# EAGLE design Teensylu-0.1 (EAGLE 5.11)
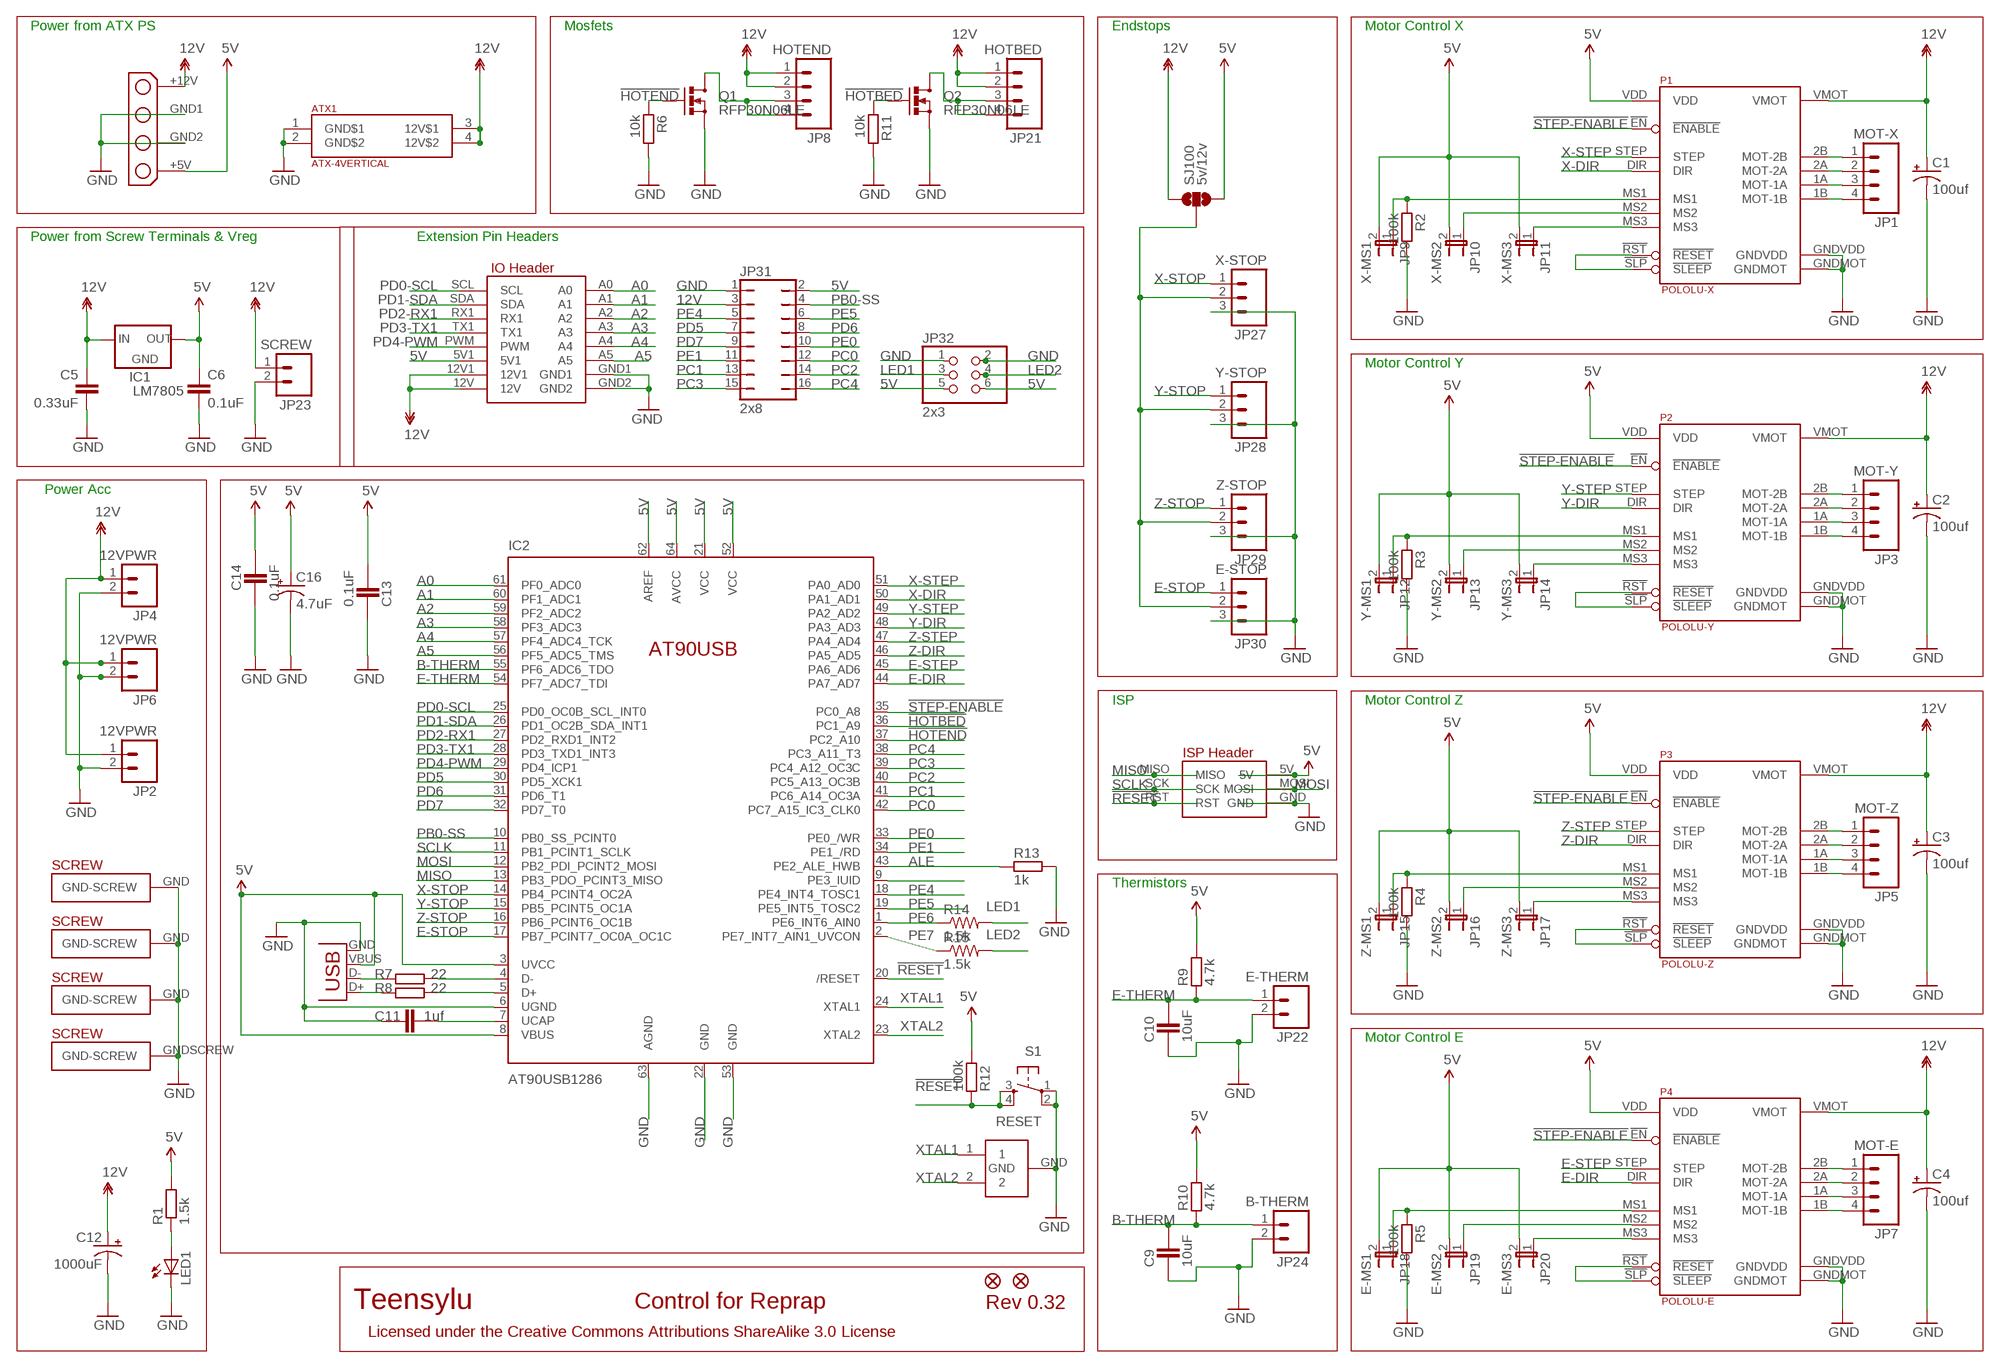
[diagram p0: schematic, sheet 1]

## Parts
ATX1  ATX-4VERTICAL  [MINIFITJR-4-VERTICAL]
C1  100uf  CAP_POLPTH1  [CPOL-RADIAL-100UF-25V]
C2  100uf  CAP_POLPTH1  [CPOL-RADIAL-100UF-25V]
C3  100uf  CAP_POLPTH1  [CPOL-RADIAL-100UF-25V]
C4  100uf  CAP_POLPTH1  [CPOL-RADIAL-100UF-25V]
C5  0.33uF  CAPPTH2  [CAP-PTH-SMALL2]
C6  0.1uF  CAPPTH2  [CAP-PTH-SMALL2]
C9  10uF  CAPACITOR_0805  [CAPC2012X145AN]
C10  10uF  CAPACITOR_0805  [CAPC2012X145AN]
C11  1uf  CAPACITOR_0805  [CAPC2012X145AN]
C12  1000uF  CAP_POLPTH4  [CPOL-RADIAL-1000UF-25V]
C13  0.1uF  CAPACITOR_0805  [CAPC2012X145AN]
C14  0.1uF  CAPACITOR_0805  [CAPC2012X145AN]
C16  4.7uF  CAP_POLPTH2  [CPOL-RADIAL-10UF-25V]
HDDPWR  5v/12v  DRIVEPWRVERTICAL  [HDD-VERTICAL]
IC1  LM7805  VREG-NOGND  [VREG-NOGND]
IC2  AT90USB1286  AT90USB-TQFP  [TQFP64]
J1  USB  USBPTH  [USB-B-PTH]
JP1  MOT-X  M04POLAR  [MOLEX-1X4]
JP2  12VPWR  M02POLAR  [MOLEX-1X2]
JP3  MOT-Y  M04POLAR  [MOLEX-1X4]
JP4  12VPWR  M02POLAR  [MOLEX-1X2]
JP5  MOT-Z  M04POLAR  [MOLEX-1X4]
JP6  12VPWR  M02POLAR  [MOLEX-1X2]
JP7  MOT-E  M04POLAR  [MOLEX-1X4]
JP8  HOTEND  M04POLAR  [MOLEX-1X4]
JP9  X-MS1  JUMPER-2PTH  [1X02]
JP10  X-MS2  JUMPER-2PTH  [1X02]
JP11  X-MS3  JUMPER-2PTH  [1X02]
JP12  Y-MS1  JUMPER-2PTH  [1X02]
JP13  Y-MS2  JUMPER-2PTH  [1X02]
JP14  Y-MS3  JUMPER-2PTH  [1X02]
JP15  Z-MS1  JUMPER-2PTH  [1X02]
JP16  Z-MS2  JUMPER-2PTH  [1X02]
JP17  Z-MS3  JUMPER-2PTH  [1X02]
JP18  E-MS1  JUMPER-2PTH  [1X02]
JP19  E-MS2  JUMPER-2PTH  [1X02]
JP20  E-MS3  JUMPER-2PTH  [1X02]
JP21  HOTBED  M04POLAR  [MOLEX-1X4]
JP22  E-THERM  M02PTH  [1X02]
JP23  SCREW  M025MM  [SCREWTERMINAL-5MM-2]
JP24  B-THERM  M02PTH  [1X02]
JP26  FIDUCIAL1X2.5  [FIDUCIAL-1X2.5]
JP27  X-STOP  M03POLAR  [MOLEX-1X3]
JP28  Y-STOP  M03POLAR  [MOLEX-1X3]
JP29  Z-STOP  M03POLAR  [MOLEX-1X3]
JP30  E-STOP  M03POLAR  [MOLEX-1X3]
JP31  2x8  JP8Q  [JP8Q]
JP32  2x3  PINHD-2X3  [2X03]
JP33  FIDUCIAL1X2.5  [FIDUCIAL-1X2.5]
LED1  LED5MM  [LED5MM]
P1  POLOLU-X  POLOLU-ALLEGRO  [POLOLU-ALLEGRO-PTH]
P2  POLOLU-Y  POLOLU-ALLEGRO  [POLOLU-ALLEGRO-PTH]
P3  POLOLU-Z  POLOLU-ALLEGRO  [POLOLU-ALLEGRO-PTH]
P4  POLOLU-E  POLOLU-ALLEGRO  [POLOLU-ALLEGRO-PTH]
Q1  RFP30N06LE  MOSFET-NCHANNELPTH2  [TO220V]
Q2  RFP30N06LE  MOSFET-NCHANNELPTH2  [TO220V]
R1  1.5k  R-EU_0204/5  [0204/5]
R2  100k  RESISTOR_0805  [RESC2012X70N]
R3  100k  RESISTOR_0805  [RESC2012X70N]
R4  100k  RESISTOR_0805  [RESC2012X70N]
R5  100k  RESISTOR_0805  [RESC2012X70N]
R6  10k  RESISTOR_0805  [RESC2012X70N]
R7  22  RESISTOR_0805  [RESC2012X70N]
R8  22  RESISTOR_0805  [RESC2012X70N]
R9  4.7k  RESISTOR_0805  [RESC2012X70N]
R10  4.7k  RESISTOR_0805  [RESC2012X70N]
R11  10k  RESISTOR_0805  [RESC2012X70N]
R12  100k  RESISTOR_0805  [RESC2012X70N]
R13  1k  RESISTOR_0805  [RESC2012X70N]
R14  1.5k  R-US_R0805  [R0805]
R15  1.5k  R-US_R0805  [R0805]
S1  RESET  TAC_SWITCHPTH  [TACTILE-PTH]
SJ100  5v/12v  SOLDERJUMPER_2WAYS  [SJ_3]
U$17  PLATED-SCREW  [PLATEDSCREW]
U$24  PLATED-SCREW  [PLATEDSCREW]
U$34  IO_HEADERS_SCREW  [IO_HEADER-PLATEDSCREW]
U$37  PLATED-SCREW  [PLATEDSCREW]
XTAL  KYOCERA_PQRC_TYPE_S_RESONATOR  [AVX_3.2X1.3_RESONATOR]

## Nets
5V: C6.1 C13.2 C14.1 C16.1(+) HDDPWR.+5V IC1.OUT IC2.3(UVCC) IC2.8(VBUS) IC2.21(VCC) IC2.52(VCC) IC2.62(AREF) IC2.64(AVCC) J1.VBUS JP9.2 JP10.2 JP11.2 JP12.2 JP13.2 JP14.2 JP15.2 JP16.2 JP17.2 JP18.2 JP19.2 JP20.2 JP31.2 JP32.5 JP32.6 P1.VDD P2.VDD P3.VDD P4.VDD R1.2 R9.2 R10.2 R12.2 SJ100.3 U$34.5V U$34.5V1
12V: ATX1.3(12V$1) ATX1.4(12V$2) C1.1(+) C2.1(+) C3.1(+) C4.1(+) C5.1 C12.1(+) HDDPWR.+12V IC1.IN JP2.1 JP4.1 JP6.1 JP8.1 JP8.2 JP21.1 JP21.2 JP23.1 JP31.3 P1.VMOT P2.VMOT P3.VMOT P4.VMOT SJ100.1 U$34.12V U$34.12V1
!HOTBED: IC2.41(PC6_A14_OC3A) Q2.1(G) R11.1
!HOTEND: IC2.40(PC5_A13_OC3B) Q1.1(G) R6.1
!RESET: IC2.20(/RESET) R12.1 S1.3 S1.4 U$34.RST
!STEP-ENABLE: IC2.42(PC7_A15_IC3_CLK0) P1.!EN(!ENABLE) P2.!EN(!ENABLE) P3.!EN(!ENABLE) P4.!EN(!ENABLE)
A0: IC2.61(PF0_ADC0) U$34.A0
A1: IC2.60(PF1_ADC1) U$34.A1
A2: IC2.59(PF2_ADC2) U$34.A2
A3: IC2.58(PF3_ADC3) U$34.A3
A4: IC2.57(PF4_ADC4_TCK) U$34.A4
A5: IC2.56(PF5_ADC5_TMS) U$34.A5
ALE: IC2.43(PE2_ALE_HWB) R13.1
B-THERM: C9.2 IC2.55(PF6_ADC6_TDO) JP24.1 R10.1
E-DIR: IC2.44(PA7_AD7) P4.DIR
E-MOT-1A [power]: JP7.3 P4.1A(MOT-1A)
E-MOT-1B [power]: JP7.4 P4.1B(MOT-1B)
E-MOT-2A [power]: JP7.2 P4.2A(MOT-2A)
E-MOT-2B [power]: JP7.1 P4.2B(MOT-2B)
E-MS1: JP18.1 P4.MS1 R5.1
E-MS2: JP19.1 P4.MS2
E-MS3: JP20.1 P4.MS3
E-RESETSLEEP: P4.!RST(!RESET) P4.!SLP(!SLEEP)
E-STEP: IC2.45(PA6_AD6) P4.STEP
E-STOP: IC2.17(PB7_PCINT7_OC0A_OC1C) JP30.1
E-THERM: C10.2 IC2.54(PF7_ADC7_TDI) JP22.1 R9.1
ENDSTOP+V: JP27.2 JP28.2 JP29.2 JP30.2 SJ100.2
GND [power]: ATX1.1(GND$1) ATX1.2(GND$2) C1.2(-) C2.2(-) C3.2(-) C4.2(-) C5.2 C6.2 C9.1 C10.1 C11.1 C12.2(-) C13.1 C14.2 C16.2(-) HDDPWR.GND1(GND) HDDPWR.GND2(_GND) IC2.6(UGND) IC2.22(GND) IC2.53(GND) IC2.63(AGND) J1.GND JP2.2 JP4.2 JP6.2 JP22.2 JP23.2 JP24.2 JP27.3 JP28.3 JP29.3 JP30.3 JP31.1 JP32.1 JP32.2 LED1.K(C) P1.GNDMOT P1.GNDVDD P2.GNDMOT P2.GNDVDD P3.GNDMOT P3.GNDVDD P4.GNDMOT P4.GNDVDD Q1.3(S) Q2.3(S) R2.2 R3.2 R4.2 R5.2 R6.2 R11.2 R13.2 S1.1 S1.2 U$17.GND(GND-SCREW) U$24.GND(GND-SCREW) U$34.GND U$34.GND1 U$34.GND2 U$34.GNDSCREW(GND-SCREW) U$37.GND(GND-SCREW) XTAL.GND
HOTBED-GND [power]: JP21.3 JP21.4 Q2.2(D)
HOTEND-GND [power]: JP8.3 JP8.4 Q1.2(D)
LED1: JP32.3 R14.2
LED2: JP32.4 R15.2
MISO: IC2.13(PB3_PDO_PCINT3_MISO) U$34.MISO
MOSI: IC2.12(PB2_PDI_PCINT2_MOSI) U$34.MOSI
N$1: LED1.A R1.1
N$2: J1.D- R7.1
N$3: IC2.4(D-) R7.2
N$4: IC2.5(D+) R8.2
N$5: J1.D+ R8.1
N$9: C11.2 IC2.7(UCAP)
N$14: IC2.9(PE3_IUID)
PB0-SS: IC2.10(PB0_SS_PCINT0) JP31.4
PC0: IC2.35(PC0_A8) JP31.12
PC1: IC2.36(PC1_A9) JP31.13
PC2: IC2.37(PC2_A10) JP31.14
PC3: IC2.38(PC3_A11_T3) JP31.15
PC4: IC2.39(PC4_A12_OC3C) JP31.16
PD0-SCL: IC2.25(PD0_OC0B_SCL_INT0) U$34.SCL
PD1-SDA: IC2.26(PD1_OC2B_SDA_INT1) U$34.SDA
PD2-RX1: IC2.27(PD2_RXD1_INT2) U$34.RX1
PD3-TX1: IC2.28(PD3_TXD1_INT3) U$34.TX1
PD4-PWM: IC2.29(PD4_ICP1) U$34.PWM
PD5: IC2.30(PD5_XCK1) JP31.7
PD6: IC2.31(PD6_T1) JP31.8
PD7: IC2.32(PD7_T0) JP31.9
PE0: IC2.33(PE0_/WR) JP31.10
PE1: IC2.34(PE1_/RD) JP31.11
PE4: IC2.18(PE4_INT4_TOSC1) JP31.5
PE5: IC2.19(PE5_INT5_TOSC2) JP31.6
PE6: IC2.1(PE6_INT6_AIN0) R14.1
PE7: IC2.2(PE7_INT7_AIN1_UVCON) R15.1
SCLK: IC2.11(PB1_PCINT1_SCLK) U$34.SCK
X-DIR: IC2.50(PA1_AD1) P1.DIR
X-MOT-1A [power]: JP1.3 P1.1A(MOT-1A)
X-MOT-1B [power]: JP1.4 P1.1B(MOT-1B)
X-MOT-2A [power]: JP1.2 P1.2A(MOT-2A)
X-MOT-2B [power]: JP1.1 P1.2B(MOT-2B)
X-MS1: JP9.1 P1.MS1 R2.1
X-MS2: JP10.1 P1.MS2
X-MS3: JP11.1 P1.MS3
X-RESETSLEEP: P1.!RST(!RESET) P1.!SLP(!SLEEP)
X-STEP: IC2.51(PA0_AD0) P1.STEP
X-STOP: IC2.14(PB4_PCINT4_OC2A) JP27.1
XTAL1: IC2.24(XTAL1) XTAL.1
XTAL2: IC2.23(XTAL2) XTAL.2
Y-DIR: IC2.48(PA3_AD3) P2.DIR
Y-MOT-1A [power]: JP3.3 P2.1A(MOT-1A)
Y-MOT-1B [power]: JP3.4 P2.1B(MOT-1B)
Y-MOT-2A [power]: JP3.2 P2.2A(MOT-2A)
Y-MOT-2B [power]: JP3.1 P2.2B(MOT-2B)
Y-MS1: JP12.1 P2.MS1 R3.1
Y-MS2: JP13.1 P2.MS2
Y-MS3: JP14.1 P2.MS3
Y-RESETSLEEP: P2.!RST(!RESET) P2.!SLP(!SLEEP)
Y-STEP: IC2.49(PA2_AD2) P2.STEP
Y-STOP: IC2.15(PB5_PCINT5_OC1A) JP28.1
Z-DIR: IC2.46(PA5_AD5) P3.DIR
Z-MOT-1A [power]: JP5.3 P3.1A(MOT-1A)
Z-MOT-1B [power]: JP5.4 P3.1B(MOT-1B)
Z-MOT-2A [power]: JP5.2 P3.2A(MOT-2A)
Z-MOT-2B [power]: JP5.1 P3.2B(MOT-2B)
Z-MS1: JP15.1 P3.MS1 R4.1
Z-MS2: JP16.1 P3.MS2
Z-MS3: JP17.1 P3.MS3
Z-RESETSLEEP: P3.!RST(!RESET) P3.!SLP(!SLEEP)
Z-STEP: IC2.47(PA4_AD4) P3.STEP
Z-STOP: IC2.16(PB6_PCINT6_OC1B) JP29.1

## Notes on the sheet
- Power from ATX PS | Mosfets | Endstops | Motor Control X
- Power from Screw Terminals & Vreg | Extension Pin Headers
- Motor Control Y
- Power Acc
- ISP | Motor Control Z
- Thermistors
- Motor Control E
- Teensylu | Control for Reprap | Rev 0.32
- Licensed under the Creative Commons Attributions ShareAlike 3.0 License

## Library data of the parts
ATX1 = atx-power-supply:ATX-4
C1-C4 C12 C16 = SparkFun:CAP_POL: Capacitor Polarized These are standard SMD and PTH capacitors. Normally 10uF, 47uF, and 100uF in electrolytic and tantalum varieties. Always verify the external diameter of the through hole cap, it varies with capacity, voltage, and manufacturer. The EIA devices should be standard.
C5 C6 = SparkFun:CAP: Capacitor Standard 0603 ceramic capacitor, and 0.1" leaded capacitor.
C9-C11 C13 C14 = ipc-7351-capacitor:CAPACITOR_
HDDPWR = atx-power-supply:DRIVEPWR
IC1 = vreg:VREG-NOGND
IC2 = Atmel-at90usb-teensy:AT90USB
J1 = SparkFun:USB: USB Connectors USB-B-PTH is fully proven SKU : PRT-00139 USB-miniB is fully proven SKU : PRT-00587 USB-A-PCB is untested. USB-A-H is throughly reviewed, but untested. Spark Fun Electronics SKU : PRT-00437 USB-B-SMT is throughly reviewed, but untested. Needs silkscreen touching up. USB-A-S has not been used/tested USB-MB-H has not been used/tested
JP1 JP3 JP5 JP7 JP8 JP21 = SparkFun:M04: Header 4 Standard 4-pin 0.1" header. Use with straight break away headers (SKU : PRT-00116), right angle break away headers (PRT-00553), swiss pins (PRT-00743), machine pins (PRT-00117), and female headers (PRT-00115). Molex polarized connector foot print use with SKU : PRT-08231 with associated crimp pins and housings.
JP2 JP4 JP6 JP22-JP24 = SparkFun:M02: Header 2 Standard 2-pin 0.1" header. Use with straight break away headers (SKU : PRT-00116), right angle break away headers (PRT-00553), swiss pins (PRT-00743), machine pins (PRT-00117), and female headers (PRT-00115). Molex polarized connector foot print use with SKU : PRT-08233 with associated crimp pins and housings.
JP9-JP20 = SparkFun:JUMPER-2: Jumper Basic 0.1" spaced jumper. Use with breakaway headers.
JP26 JP33 = SparkFun:FIDUCIAL: Fiducial Alignment Points Various fiducial points for machine vision alignment.
JP27-JP30 = SparkFun:M03: Header 3 Standard 3-pin 0.1" header. Use with straight break away headers (SKU : PRT-00116), right angle break away headers (PRT-00553), swiss pins (PRT-00743), machine pins (PRT-00117), and female headers (PRT-00115). Molex polarized connector foot print use with SKU : PRT-08232 with associated crimp pins and housings.
JP31 = jumper:JP8Q: JUMPER
JP32 = pinhead:PINHD-2X3: PIN HEADER
LED1 = led:LED: LED OSRAM: - CHIPLED LG R971, LG N971, LY N971, LG Q971, LY Q971, LO R971, LY R971 LH N974, LH R974 LS Q976, LO Q976, LY Q976 LO Q996 - Hyper CHIPLED LW Q18S LB Q993, LB Q99A, LB R99A - SideLED LS A670, LO A670, LY A670, LG A670, LP A670 LB A673, LV A673, LT A673, LW A673 LH A674 LY A675 LS A676, LA A676, LO A676, LY A676, LW A676 LS A679, LY A679, LG A679 - Hyper Micro SIDELED® LS Y876, LA Y876, LO Y876, LY Y876 LT Y87S - SmartLED LW L88C, LW L88S LB L89C, LB L89S, LG L890 LS L89K, LO L89K, LY L89K LS L896, LA L896, LO L896, LY L896 - TOPLED LS T670, LO T670, LY T670, LG T670, LP T670 LSG T670, LSP T670, LSY T670, LOP T670, LYG T670 LG T671, LOG T671, LSG T671 LB T673, LV T673, LT T673, LW T673 LH T674 LS T676, LA T676, LO T676, LY T676, LB T676, LH T676, LSB T676, LW T676 LB T67C, LV T67C, LT T67C, LS T67K, LO T67K, LY T67K, LW E67C LS E67B, LA E67B, LO E67B, LY E67B, LB E67C, LV E67C, LT E67C LW T67C LS T679, LY T679, LG T679 LS T770, LO T770, LY T770, LG T770, LP T770 LB T773, LV T773, LT T773, LW T773 LH T774 LS E675, LA E675, LY E675, LS T675 LS T776, LA T776, LO T776, LY T776, LB T776 LHGB T686 LT T68C, LB T68C - Hyper Mini TOPLED® LB M676 - Mini TOPLED Santana® LG M470 LS M47K, LO M47K, LY M47K Source: http://www.osram.convergy.de LUXEON: - LUMILED® LXK2-PW12-R00, LXK2-PW12-S00, LXK2-PW14-U00, LXK2-PW14-V00 LXK2-PM12-R00, LXK2-PM12-S00, LXK2-PM14-U00 LXK2-PE12-Q00, LXK2-PE12-R00, LXK2-PE12-S00, LXK2-PE14-T00, LXK2-PE14-U00 LXK2-PB12-K00, LXK2-PB12-L00, LXK2-PB12-M00, LXK2-PB14-N00, LXK2-PB14-P00, LXK2-PB14-Q00 LXK2-PR12-L00, LXK2-PR12-M00, LXK2-PR14-Q00, LXK2-PR14-R00 LXK2-PD12-Q00, LXK2-PD12-R00, LXK2-PD12-S00 LXK2-PH12-R00, LXK2-PH12-S00 LXK2-PL12-P00, LXK2-PL12-Q00, LXK2-PL12-R00 Source: www.luxeon.com KINGBRIGHT: KA-3528ASYC Source: www.kingbright.com
P1-P4 = pololu-allegro:POLOLU-ALLEGRO
Q1 Q2 = SparkFun:MOSFET-NCHANNEL
R1 = rcl:R-EU_: RESISTOR, European symbol
R2-R13 = ipc-7351-resistor:RESISTOR_
R14 R15 = rcl:R-US_: RESISTOR, American symbol
S1 = SparkFun:TAC_SWITCH: Momentary Switch Button commonly used for reset or general input. Spark Fun Electronics SKU : COM-00097
SJ100 = SparkFun:SOLDERJUMPER_2WAY: Solder Jumper 2 way solder jumper
U$17 U$24 U$37 = Sanguinololu:PLATED-SCREW
U$34 = Sanguinololu:IO_HEADERS_SCREW
XTAL = Kyocera_Resonator:KYOCERA_PQRC_TYPE_S_RESONATOR

## Board
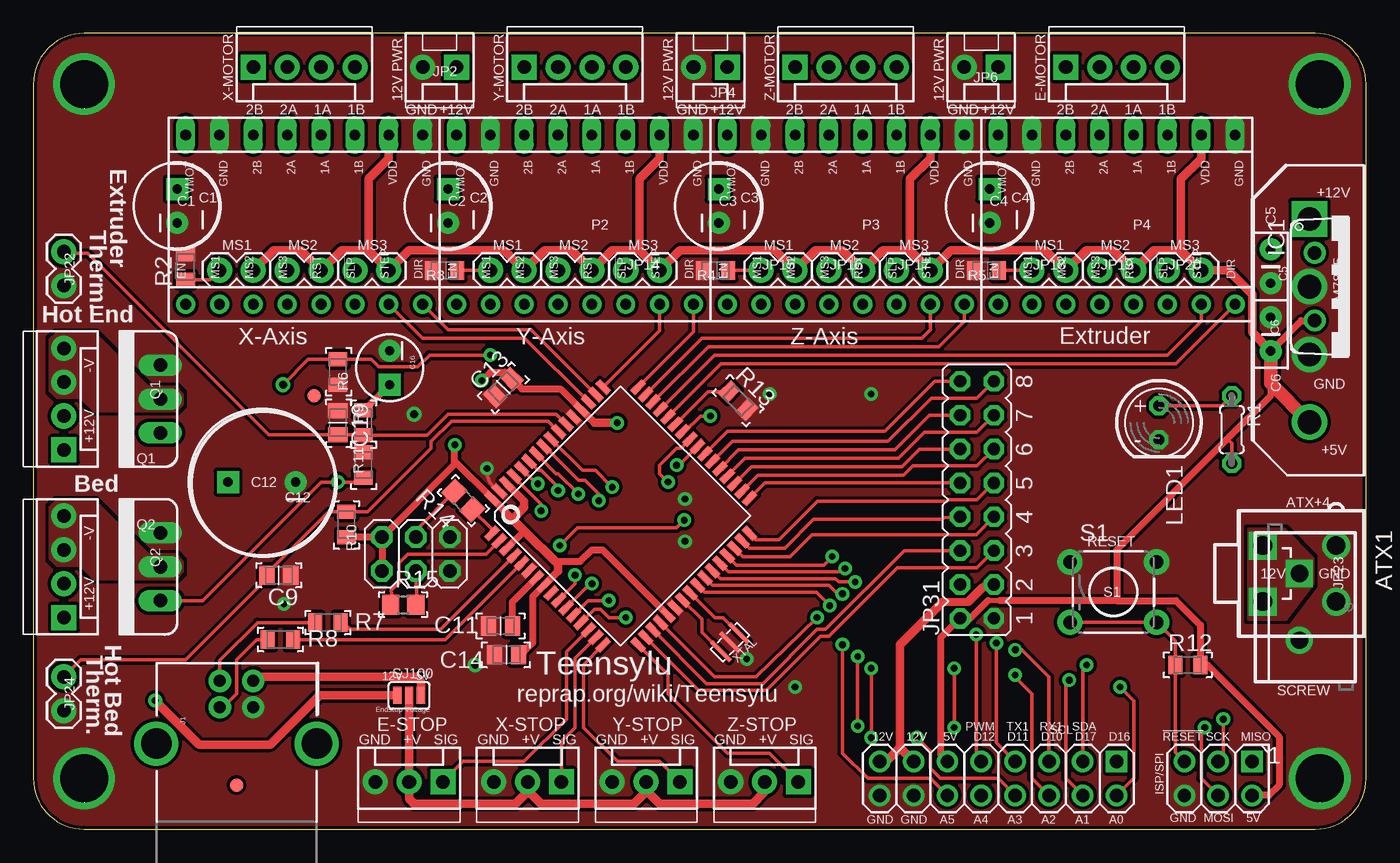
[diagram p1: board, top side]
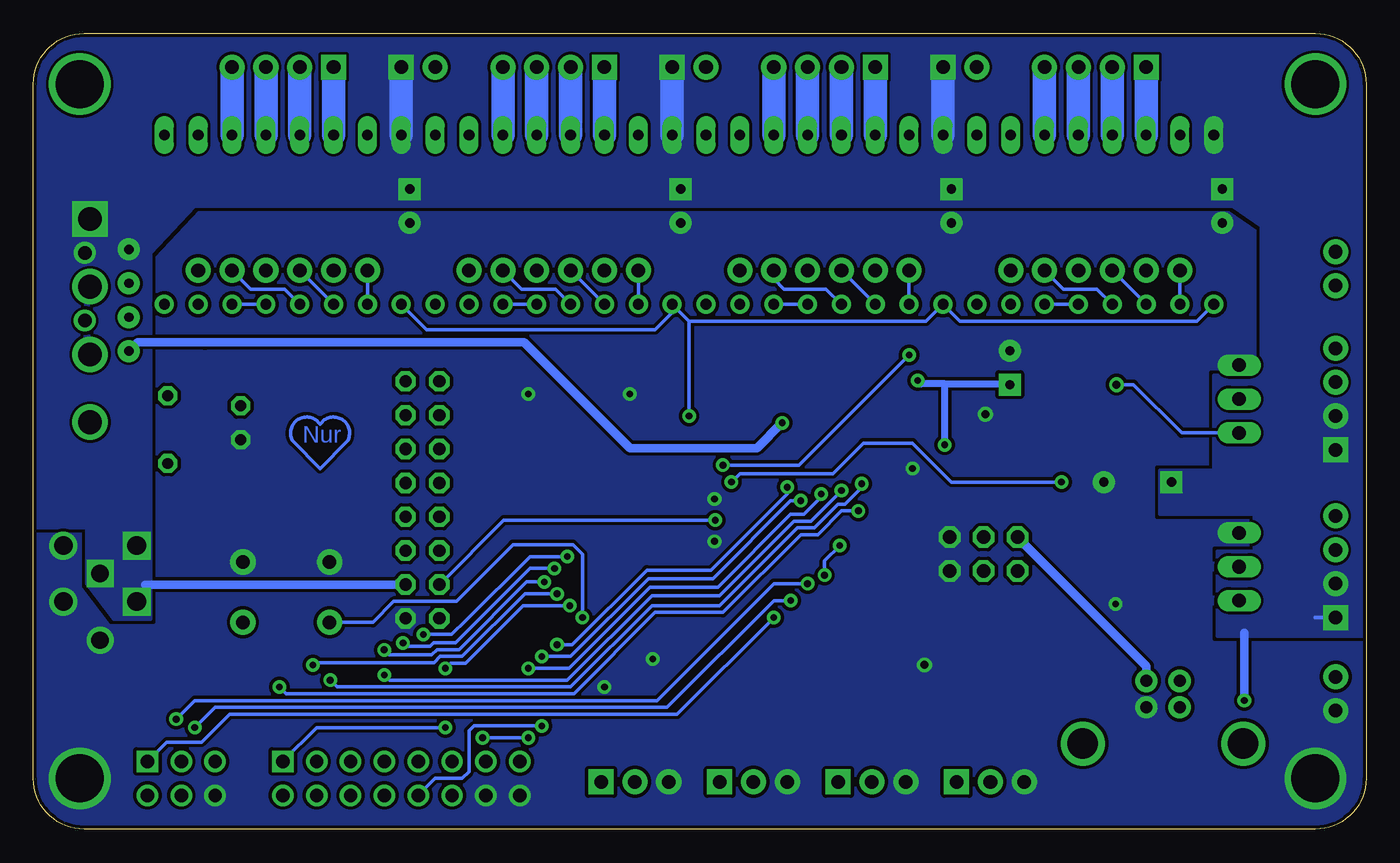
[diagram p2: board, bottom side, seen from below]

Size 100 x 59.69 mm. Coordinates in mm from the lower left corner, seen from the top.
Outline: 0,3.81 arc90 3.81,0 96.19,0 arc90 100,3.81 100,55.88 arc90 96.19,59.69 3.81,59.69 arc90 0,55.88 0,3.81
Copper layers (1*16): Top 0.035mm / dielectric 1.5mm / Bottom 0.035mm
Design rules "SparkFun": minimum track width 8mil, minimum drill 20mil, track to track 8mil, track to pad 8mil, pad to pad 8mil, via to via 8mil, smd to smd 8mil, copper to edge 10mil, drill to drill 8mil, minimum pad ring 12mil, minimum via ring 10mil, stop-mask expansion 4mil, vias tented up to drill 25mil, thermal gap 10mil

### Footprints (pad centres in the part's own frame; a part is rotated, then mirrored left to right if it is on the bottom)
MINIFITJR-4-VERTICAL = drill 1.4 round: 1 2.1,-2.75; 2 -2.1,-2.75 | drill 1.4 square: 3 2.1,2.75; 4 -2.1,2.75
CPOL-RADIAL-100UF-25V = drill 0.7 pad 1.651 square: 1 1.27,0 | drill 0.7 pad 1.651 round: 2 -1.27,0
CAP-PTH-SMALL2 = drill 0.7 pad 1.651 round: 1 0,0; 2 2.54,0
CAPC2012X145AN = smd 1.15 x 1.45: 1 -0.9,0; 2 0.9,0
CPOL-RADIAL-1000UF-25V = drill 0.7 pad 1.651 square: 1 2.54,0 | drill 0.7 pad 1.651 round: 2 -2.54,0
CPOL-RADIAL-10UF-25V = drill 0.7 pad 1.651 square: 1 1.27,0 | drill 0.7 pad 1.651 round: 2 -1.27,0
HDD-VERTICAL = drill 1.778 round: +5V -15.24,0; GND1 -10.16,0; GND2 -5.08,0 | drill 1.778 square: +12V 0,0
VREG-NOGND = drill 1.016 round: IN -2.54,0; OUT 2.54,0
TQFP64 = smd 1.194 x 0.508: 1 -7.76,5.905; 2 -7.76,5.118; 3 -7.76,4.331; 4 -7.76,3.543; 5 -7.76,2.756; 6 -7.76,1.968; 7 -7.76,1.181; 8 -7.76,0.394; 9 -7.76,-0.394; 10 -7.76,-1.181; 11 -7.76,-1.968; 12 -7.76,-2.756; 13 -7.76,-3.543; 14 -7.76,-4.331; 15 -7.76,-5.118; 16 -7.76,-5.905; 33 7.76,-5.905; 34 7.76,-5.118; 35 7.76,-4.331; 36 7.76,-3.543; 37 7.76,-2.756; 38 7.76,-1.968; 39 7.76,-1.181; 40 7.76,-0.394; 41 7.76,0.394; 42 7.76,1.181; 43 7.76,1.968; 44 7.76,2.756; 45 7.76,3.543; 46 7.76,4.331; 47 7.76,5.118; 48 7.76,5.905 | smd 0.508 x 1.194: 17 -5.905,-7.76; 18 -5.118,-7.76; 19 -4.331,-7.76; 20 -3.543,-7.76; 21 -2.756,-7.76; 22 -1.968,-7.76; 23 -1.181,-7.76; 24 -0.394,-7.76; 25 0.394,-7.76; 26 1.181,-7.76; 27 1.968,-7.76; 28 2.756,-7.76; 29 3.543,-7.76; 30 4.331,-7.76; 31 5.118,-7.76; 32 5.905,-7.76; 49 5.905,7.76; 50 5.118,7.76; 51 4.331,7.76; 52 3.543,7.76; 53 2.756,7.76; 54 1.968,7.76; 55 1.181,7.76; 56 0.394,7.76; 57 -0.394,7.76; 58 -1.181,7.76; 59 -1.968,7.76; 60 -2.756,7.76; 61 -3.543,7.76; 62 -4.331,7.76; 63 -5.118,7.76; 64 -5.905,7.76
USB-B-PTH = drill 0.914 pad 1.676 round: D+ 0,1.25; D- 1.981,1.25; GND 0,-1.25; VBUS 1.981,-1.25 | drill 2.286 round: P$1 -2.718,-6.02; P$2 -2.718,6.02
MOLEX-1X4 = drill 1.016 pad 1.88 square: 1 0,0 | drill 1.016 pad 1.88 round: 2 2.54,0; 3 5.08,0; 4 7.62,0
MOLEX-1X2 = drill 1.016 pad 1.88 square: 1 0,0 | drill 1.016 pad 1.88 round: 2 2.54,0
1X02 = drill 1.016 pad 1.88 round: 1 0,0; 2 2.54,0
SCREWTERMINAL-5MM-2 = drill 1.3 pad 2.032 square: 1 0,0 | drill 1.3 pad 2.032 round: 2 5,0
FIDUCIAL-1X2.5 = smd 1 x 1: 1 0,0
MOLEX-1X3 = drill 1.016 pad 1.88 square: 1 0,0 | drill 1.016 pad 1.88 round: 2 2.54,0; 3 5.08,0
JP8Q = drill 0.914 octagon: 1 -8.89,-1.27; 2 -8.89,1.27; 3 -6.35,-1.27; 4 -6.35,1.27; 5 -3.81,-1.27; 6 -3.81,1.27; 7 -1.27,-1.27; 8 -1.27,1.27; 9 1.27,-1.27; 10 1.27,1.27; 11 3.81,-1.27; 12 3.81,1.27; 13 6.35,-1.27; 14 6.35,1.27; 15 8.89,-1.27; 16 8.89,1.27
2X03 = drill 1.016 octagon: 1 -2.54,-1.27; 2 -2.54,1.27; 3 0,-1.27; 4 0,1.27; 5 2.54,-1.27; 6 2.54,1.27
LED5MM = drill 0.813 octagon: A -1.27,0; K 1.27,0
POLOLU-ALLEGRO-PTH = drill 0.8 pad 1.422 long: 1A 6.35,-1.27; 1B 6.35,-3.81; 2A 6.35,1.27; 2B 6.35,3.81; GNDMOT 6.35,6.35; GNDVDD 6.35,-8.89; VDD 6.35,-6.35; VMOT 6.35,8.89 | drill 0.8 pad 1.422 round: !EN -6.35,8.89; !RST -6.35,-1.27; !SLP -6.35,-3.81; DIR -6.35,-8.89; MS1 -6.35,6.35; MS2 -6.35,3.81; MS3 -6.35,1.27; STEP -6.35,-6.35
TO220V = drill 1.016 long: 1 -2.54,0; 2 0,0; 3 2.54,0
0204/5 = drill 0.813 octagon: 1 -2.54,0; 2 2.54,0
RESC2012X70N = smd 1.05 x 1.4: 1 -0.95,0; 2 0.95,0
R0805 = smd 1.3 x 1.5: 1 -0.95,0; 2 0.95,0
TACTILE-PTH = drill 1.016 pad 1.88 round: 1 -3.251,2.261; 2 3.251,2.261; 3 -3.251,-2.261; 4 3.251,-2.261
SJ_3 = smd 0.635 x 1.27: 1 -0.889,0; 2 0,0; 3 0.889,0
PLATEDSCREW = drill 3.6 round: GND 0,0
IO_HEADER-PLATEDSCREW = drill 1 round: 5V -5.08,-1.27; 5V1 -27.94,1.27; 12V -33.02,1.27; 12V1 -30.48,1.27; A0 -15.24,-1.27; A1 -17.78,-1.27; A2 -20.32,-1.27; A3 -22.86,-1.27; A4 -25.4,-1.27; A5 -27.94,-1.27; GND -10.16,-1.27; GND1 -30.48,-1.27; GND2 -33.02,-1.27; MOSI -7.62,-1.27; PWM -25.4,1.27; RST -10.16,1.27; RX1 -20.32,1.27; SCK -7.62,1.27; SDA -17.78,1.27; TX1 -22.86,1.27 | drill 3.6 round: GNDSCREW 0,0 | drill 1 square: MISO -5.08,1.27; SCL -15.24,1.27
AVX_3.2X1.3_RESONATOR = smd 0.3 x 2: 1 -0.95,0; 2 0.95,0; GND 0,0

### Placement (x,y rotation side)
ATX1  95,19.18 90 top
C1  10.79,46.74 90 top
C2  31.11,46.74 90 top
C3  51.44,46.74 90 top
C4  71.75,46.74 90 top
C5  92.84,43.48 270 top
C6  92.84,35.86 90 top
C9  18.41,19.05 180 top
C10  22.86,30.48 270 top
C11  35.05,15.24 0 top
C12  17.14,26.04 180 top
C13  35.26,33.14 45 top
C14  35.51,13.08 180 top
C16  26.73,34.61 270 top
HDDPWR  95.74,45.77 90 top
IC1  96.14,40.69 270 top
IC2  44.07,23.5 45 top
J1  15.24,9.14 90 top
JP1  16.51,57.15 0 top
JP2  31.75,57.15 180 top
JP3  36.83,57.15 0 top
JP4  52.07,57.15 180 top
JP5  57.15,57.15 0 top
JP6  72.39,57.15 180 top
JP7  77.47,57.15 0 top
JP8  2.29,28.45 90 top
JP9  13.97,41.91 0 top
JP10  19.05,41.91 0 top
JP11  24.13,41.91 0 top
JP12  34.29,41.91 0 top
JP13  39.37,41.91 0 top
JP14  44.45,41.91 0 top
JP15  54.61,41.91 0 top
JP16  59.69,41.91 0 top
JP17  64.77,41.91 0 top
JP18  74.93,41.91 0 top
JP19  80.01,41.91 0 top
JP20  85.09,41.91 0 top
JP21  2.29,15.88 90 top
JP22  2.29,43.31 270 top
JP23  95,19.18 270 top
JP24  2.29,11.43 270 top
JP26  21.08,32.51 0 top
JP27  30.73,3.56 180 top
JP28  39.62,3.56 180 top
JP29  48.51,3.56 180 top
JP30  57.4,3.56 180 top
JP31  70.8,24.7 90 top
JP32  28.7,20.64 180 top
JP33  15.24,3.3 0 top
LED1  84.45,30.48 270 top
P1  20.32,45.72 90 top
P2  40.64,45.72 90 top
P3  60.96,45.72 90 top
P4  81.28,45.72 90 top
Q1  9.53,32.26 90 top
Q2  9.53,19.68 90 top
R1  89.92,29.97 270 top
R2  11.43,42.16 90 top
R3  30.86,41.91 180 top
R4  51.18,41.91 180 top
R5  71.5,41.91 180 top
R6  22.86,34.29 270 top
R7  22.1,15.49 0 top
R8  18.54,14.22 0 top
R9  24.77,30.48 90 top
R10  23.5,22.86 270 top
R11  24.77,27.3 90 top
R12  86.61,12.32 0 top
R13  52.88,32.15 315 top
R14  32.26,24.64 135 top
R15  27.76,16.84 0 top
S1  81.03,17.78 0 top
SJ100  28.19,10.03 0 top
U$17  3.81,3.81 0 top
U$24  96.52,55.88 0 top
U$34  96.52,3.81 0 top
U$37  3.81,55.88 0 top
XTAL  52.27,14.02 225 top

### Tracks (layer width: path | path; a pad name or v marks a point on that pad's centre or on a via)
5V  (via drill 0.51)
  Top 0.254: R12.2 88.07,12.32 | R1.2 89.92,28.96 89.6,29.27
  Top 0.381: 72.52,17.14 71.63,17.14
  Top 0.508: IC2.21 42.71,20.95 41.91,20.95 41.04,20.08 39.13,20.08 | C14.1 36.83,13.34 37.47,13.97 37.47,17.45 IC2.8 | IC2.52 39.55,33.02 36.65,33.02 C13.2 35.38,34.29 34.29,34.29 v33.66,33.66 | JP32.5 JP32.6 | U$34.5V1 68.07,5.59 68.07,14.35 JP31.2 70.29,15.81 71.63,17.14 | 36.97,22.24 36.69,22.24 IC2.3 | 31.62,27.59 v31.62,28.83 | 31.62,27.59 IC2.64 | IC1.OUT 95.12,38.15 C6.1 | 88.07,12.32 93.47,6.92 93.47,3.3 92.71,2.54 U$34.5V | R12.2 87.56,15.31 85.73,17.14 81.28,17.14 | 92.84,33.43 92.84,32.51 89.6,29.27 81.28,20.95 81.28,17.14 | R9.2 24.83,31.43 C16.1 | JP32.5 R10.2 | JP32.5 31.62,27.37 31.62,27.59 | 81.28,17.14 72.52,17.14
  Top 0.559: IC2.64 35.96,23.26 | 39.37,19.35 IC2.8 | 36.83,24.61 IC2.62 | IC2.52 42.09,30.48
  Top 0.635: J1.VBUS 16.8,11.43 28.7,11.43 29.08,11.05 SJ100.3 | 35.96,23.26 36.97,22.24 39.13,20.08 39.37,19.84 39.37,19.35 | 36.83,24.61 36.83,24.13 35.96,23.26 | 35.96,23.26 | 42.09,30.48 v43.81,30.48 | C6.1 91.44,37.26 91.44,40.13 89.66,41.91 JP20.2 86.11,43.43 | 25.15,43.43 JP11.2 28.19,43.43 35.31,43.43 JP12.2 38.35,43.43 40.39,43.43 JP13.2 43.43,43.43 45.47,43.43 | 25.15,43.43 23.11,43.43 JP10.2 20.07,43.43 18.03,43.43 JP9.2 | 45.47,43.43 JP14.2 48.51,43.43 55.63,43.43 JP15.2 58.67,43.43 60.71,43.43 JP16.2 63.75,43.43 65.79,43.43 | 65.79,43.43 JP17.2 68.83,43.43 75.95,43.43 JP18.2 78.99,43.43 81.03,43.43 JP19.2 84.07,43.43 86.11,43.43 | P1.VDD 26.67,50.29 25.15,48.77 25.15,43.43 | P2.VDD 46.99,50.29 45.47,48.77 45.47,43.43 | P3.VDD 67.31,50.29 65.79,48.77 65.79,43.43 | P4.VDD 87.63,50.29 86.11,48.77 86.11,43.43
  Top 1.016: HDDPWR.+5V 92.84,33.43 C6.1
  Bottom 0.508: 87.11,36.51 87.31,36.51 | v31.62,28.83 31.62,33.4 | 31.62,33.4 26.8,33.4 C16.1 | 31.62,33.4 33.4,33.4 v33.66,33.66
  Bottom 0.635: v43.81,30.48 45.72,28.57 55.24,28.57 63.18,36.51 87.11,36.51 92.19,36.51 C6.1 | JP32.5 16.49,12.24 J1.VBUS
12V  (via drill 0.51)
  Top 0.508: 71.25,18.16 71.37,18.22
  Top 0.584: 68.25,17.07 70.16,17.07
  Top 0.635: 68.25,17.07 65.02,13.84 65.02,6.1 | 70.16,17.07 71.25,18.16 | 71.37,18.22 JP31.3 | 65.02,6.1 U$34.12V1 | 65.02,6.1 64.01,5.08 U$34.12V | v9.14,9.65 12.45,6.35 17.78,6.35 21.46,10.03 SJ100.1
  Bottom 0.305: JP21.1 3.81,15.88
  Bottom 0.635: JP31.3 91.61,18.35 | v9.14,9.65 9.14,14.73
  Bottom 1.778: P3.VMOT JP4.1 | P2.VMOT JP2.1 | P4.VMOT JP6.1
  pour Bottom (no thermals): -1.27,14.48 11.18,14.48 11.18,20.83 8.38,20.83 8.38,23.62 15.49,23.62 15.49,26.92 11.43,26.92 11.43,34.04 7.87,34.04 7.87,45.21 10.03,46.74 87.88,46.74 91.19,43.18 91.19,15.75 93.98,15.75 96.01,18.41 96.01,22.61 101.6,22.61 101.6,60.96 -1.27,60.96
  pour Top (no thermals): 96.01,18.41 93.98,15.75 91.19,15.75 91.19,22.48 93.85,22.48 96.01,20.32
!HOTBED  (via drill 0.51)
  Top 0.254: IC2.41 48.59,28.57 48.26,28.57 46.99,27.3 46.99,26.67 v47.62,26.04 | Q2.1 12.7,17.14 21.59,26.04 v22.86,26.04 24.45,26.04 R11.1
  Bottom 0.254: v47.62,26.04 46.99,26.67 40.01,26.67 37.73,28.95 34.03,28.95 31.11,26.04 v22.86,26.04
!HOTEND  (via drill 0.51, 0.6)
  Top 0.254: v48.26,27.3 48.44,27.3 IC2.40 | v34.29,35.56 29.72,35.56 28.83,34.67 25.91,34.67 25.34,35.24 R6.1 20.64,35.24 v18.73,33.34
  Bottom 0.254: v34.29,35.56 42.55,27.3 v48.26,27.3 | Q1.1 13.84,29.72 17.46,33.34 v18.73,33.34
!RESET  (via drill 0.51)
  Top 0.254: S1.3 S1.4 85.66,14.13 R12.1 85.66,5.78 U$34.RST | IC2.20 51.12,11.43 54.23,11.43 v58.8,15.88
  Bottom 0.254: S1.3 74.52,15.52 72.96,17.08 68.26,17.08 64.01,21.34 59.51,21.34 58.8,20.62 v58.8,15.88
!STEP-ENABLE  (via drill 0.51)
  Top 0.254: IC2.42 48.87,29.82 50.04,30.99 v50.8,30.99
  Bottom 0.254: 50.8,38.1 v50.8,30.99 | 50.8,38.1 P3.!EN 52.07,38.73 53.34,37.47 70.48,37.47 P4.!EN | 50.8,38.1 33.02,38.1 P2.!EN 30.48,38.1 12.7,38.1 P1.!EN
A0  (via drill 0.51)
  Top 0.254: U$34.A0 82.55,3.81 82.55,9.65 v81.53,10.67 | IC2.61 36.08,26.41 38.1,24.38 v38.1,23.88
  Bottom 0.254: v81.53,10.67 81.03,10.16 59.44,10.16 53.34,16.26 48.26,16.26 42.42,22.1 41.15,22.1 39.37,23.88 v38.1,23.88
A1  (via drill 0.51)
  Top 0.254: U$34.A1 77.47,3.81 77.47,10.92 v77.72,11.18 | IC2.60 37.76,25.91 v37.85,25.91
  Bottom 0.254: v77.72,11.18 77.22,10.67 59.69,10.67 53.59,16.76 48.51,16.76 42.67,22.61 41.4,22.61 39.62,24.38 39.12,24.38 37.85,25.65 v37.85,25.91
A2  (via drill 0.51)
  Top 0.254: v73.66,11.56 73.66,11.43 74.93,10.16 74.93,3.81 U$34.A2 | IC2.59 37.86,26.92 38.1,26.92 39.37,25.65 v39.37,25.4
  Bottom 0.254: v73.66,11.56 73.28,11.18 59.94,11.18 53.59,17.53 48.51,17.53 42.93,23.11 41.66,23.11 v39.37,25.4
A3  (via drill 0.51)
  Top 0.254: v62.87,12.06 v62.87,6.86 | U$34.A3 72.39,3.81 68.07,3.81 67.31,4.57 67.31,5.84 v66.29,6.86 | IC2.58 39.22,26.67 39.37,26.67 v40.89,25.15
  Bottom 0.254: v62.87,12.06 59.82,12.06 53.72,18.16 48.64,18.16 43.18,23.62 42.16,23.62 40.89,24.89 v40.89,25.15 | v62.87,6.86 v66.29,6.86
A4  (via drill 0.51)
  Top 0.254: v61.85,12.95 v61.85,7.75 | IC2.57 38.35,28.7 40.89,26.16 41.4,26.16 42.42,25.15 v42.42,24.64
  Bottom 0.254: v61.85,12.95 59.69,12.95 53.85,18.8 49.02,18.8 43.18,24.64 v42.42,24.64 | U$34.A4 69.85,3.81 67.82,3.81 67.31,4.32 67.31,7.37 66.93,7.75 v61.85,7.75
A5  (via drill 0.51)
  Top 0.254: v60.71,13.84 60.71,5.71 62.61,3.81 67.31,3.81 U$34.A5 | IC2.56 41.2,26.92 42.16,26.92 v43.43,25.65
  Bottom 0.254: v60.71,13.84 59.56,13.84 53.98,19.43 49.15,19.43 43.43,25.15 v43.43,25.65
ALE
  Top 0.254: IC2.43 50.61,32.82 R13.1
B-THERM
  Top 0.254: IC2.55 38.63,30.61 31.37,30.61 29.84,29.08 29.84,28.57 25.08,23.81 R10.1 | R10.1 23.18,23.5 | JP24.1 3.56,12.7 11.43,12.7 17.52,18.79 C9.2 17.52,19.16 22.17,23.81 R10.1
E-DIR
  Top 0.254: IC2.44 51.6,34.92 85.72,34.92 P4.DIR
E-MOT-1A
  Bottom 1.778: P4.1A JP7.3
E-MOT-1B
  Bottom 1.778: P4.1B JP7.4
E-MOT-2A
  Bottom 1.778: P4.2A JP7.2
E-MOT-2B
  Bottom 1.778: P4.2B JP7.1
E-MS1
  Top 0.254: R5.1 JP18.1
  Bottom 0.254: JP18.1 P4.MS1
E-MS2
  Bottom 0.254: P4.MS2 JP19.1
E-MS3
  Bottom 0.254: P4.MS3 81.15,40.51 83.69,40.51 JP20.1
E-RESETSLEEP
  Bottom 0.254: P4.!RST P4.!SLP
E-STEP
  Top 0.254: IC2.45 51.12,35.56 85.09,35.56 87.63,38.1 P4.STEP
E-STOP
  Top 0.254: IC2.17 47.62,11.59 47.62,10.16 52.07,5.71 55.24,5.71 JP30.1
E-THERM
  Top 0.254: IC2.54 39.23,31.11 31.11,31.11 29.53,29.53 R9.1 24.71,29.58 C10.2 17.66,29.58 4.06,43.18 2.41,43.18 JP22.1
ENDSTOP+V
  Top 0.254: 37.08,2.79 JP28.2 | 45.97,2.79 JP29.2
  Top 0.635: SJ100.2 JP27.2 28.19,2.29 28.57,1.91 36.2,1.91 37.08,2.79 | JP28.2 37.08,2.92 38.1,1.91 45.09,1.91 45.97,2.79 | JP29.2 45.97,2.92 46.99,1.91 53.98,1.91 54.86,2.79 JP30.2
GND  (via drill 0.51, 0.51 pad 0.25, 0.6)
  Top 0.254: IC2.63 arc-69 v34.04,27.05
  Bottom 0.254: v34.04,27.05 34.29,27.3
  other vias: 57.15,10.67 53.53,12.76 55.24,32.64 48.9,24.77 48.9,21.59 33.15,12.32 28.57,31.11 18.8,16.89 62.87,32.64
  pour Top (isolate 0.254, rank 6, no thermals): -6.35,66.04 106.68,66.04 106.68,-2.54 -6.35,-2.54
  pour Bottom (isolate 0.254, rank 6, no thermals): -5.08,64.77 105.41,64.77 105.41,-1.27 -5.08,-1.27
HOTBED-GND
  pour Top (no thermals): 1.27,23.62 1.27,20.83 1.27,20.57 1.27,20.32 1.78,19.81 3.3,19.81 3.56,19.81 4.57,18.8 10.67,18.8 11.18,19.3 11.18,20.07 10.67,20.57 8.64,20.57 4.57,24.64 1.78,24.64 1.27,24.13
HOTEND-GND
  pour Top (no thermals): 1.27,36.2 1.27,33.4 1.27,33.15 1.27,32.89 1.78,32.38 3.3,32.38 3.56,32.38 4.57,31.37 10.67,31.37 11.18,31.88 11.18,32.64 10.67,33.15 8.64,33.15 4.57,37.21 1.78,37.21 1.27,36.7
LED1
  Top 0.254: JP32.3 28.7,22.43 R14.2
LED2
  Top 0.254: R15.2 28.78,16.84 28.7,18.54 JP32.4
MISO  (via drill 0.51)
  Top 0.254: IC2.13 42.09,16.51 42.55,16.51 43.18,15.88 v44.45,15.88
  Bottom 0.254: v44.45,15.88 51.69,8.64 85.28,8.64 87.38,6.54 89.98,6.54 U$34.MISO
MOSI  (via drill 0.51)
  Top 0.254: IC2.12 41.62,17.14 v43.18,17.14 | v87.88,7.62 87.63,7.37 87.63,3.81 U$34.MOSI
  Bottom 0.254: v43.18,17.14 44.45,17.14 52.45,9.14 86.36,9.14 v87.88,7.62
N$1
  Top 0.254: LED1.A 89.15,31.75 R1.1
N$2
  Top 0.254: J1.D- 13.99,12.65 16.83,15.49 R7.1
N$3
  Top 0.254: R7.2 23.81,14.99 30.55,14.99 IC2.4
N$4
  Top 0.254: R8.2 30.9,14.22 IC2.5
N$5
  Top 0.254: J1.D+ 14.22,9.14 15.24,10.16 15.24,12.7 16.76,14.22 R8.1
N$8
  Bottom 0.254: 80.52,29.08 arc180 78.49,30.35 arc180 76.45,29.08 78.49,27.05 80.52,29.08
N$9
  Top 0.508: C11.2 35.95,17.05 IC2.7
PB0-SS  (via drill 0.51)
  Top 0.254: IC2.10 40.64,18.4 v40.64,19.05 | v39.5,21.27 40.83,22.61 48.26,22.61 v48.83,23.18
  Bottom 0.254: v48.83,23.18 64.71,23.18 JP31.4 | v40.64,19.05 40.64,20.13 v39.5,21.27
PC0
  Top 0.254: IC2.35 53.88,27.18 65.15,27.18 66.48,28.51 JP31.12
PC1
  Top 0.254: JP31.13 70.8,29.78 66.86,29.78 64.9,27.81 53.4,27.81 IC2.36
PC2
  Top 0.254: IC2.37 52.92,28.45 64.64,28.45 67.25,31.05 JP31.14
PC3
  Top 0.254: JP31.15 70.8,32.32 67.37,32.32 64.14,29.08 52.44,29.08 IC2.38
PC4
  Top 0.254: IC2.39 52.09,29.84 63.88,29.84 67.63,33.59 JP31.16
PD0-SCL  (via drill 0.51)
  Top 0.254: v69.09,12.06 v69.09,7.62 | IC2.25 50.34,17.78 58.74,17.78 v59.75,16.76
  Bottom 0.254: v69.09,7.62 78.74,7.62 U$34.SCL | v69.09,12.06 68.71,12.45 67.56,12.45 63.25,16.76 v59.75,16.76
PD1-SDA  (via drill 0.51)
  Top 0.254: 50.39,18.82 IC2.26 50.95,18.29 59.69,18.29 60.33,17.65 v60.71,17.65 | U$34.SDA 78.74,12.04 v79.02,12.32
  Bottom 0.254: v79.02,12.32 78.84,12.5 69.93,12.5 69.47,12.95 67.82,12.95 63.12,17.65 v60.71,17.65
PD2-RX1  (via drill 0.51)
  Top 0.254: U$34.RX1 76.2,11.43 74.18,13.45 v73.67,13.45 | IC2.27 51.55,18.8 60.2,18.8 60.45,18.54 v61.66,18.54
  Bottom 0.254: v73.67,13.45 73.3,13.08 70.1,13.08 69.72,13.46 68.07,13.46 62.99,18.54 v61.66,18.54
PD3-TX1  (via drill 0.51)
  Top 0.254: v72.26,13.97 72.26,6.48 U$34.TX1 | IC2.28 52.16,19.3 60.64,19.3 v60.9,19.56
  Bottom 0.254: v72.26,13.97 72.01,13.72 70.23,13.72 69.98,13.97 68.33,13.97 62.74,19.56 v60.9,19.56
PD4-PWM  (via drill 0.51)
  Top 0.254: v59.94,20.45 59.31,19.81 52.76,19.81 IC2.29 | v70.74,14.61 70.74,5.46 U$34.PWM
  Bottom 0.254: v59.94,20.45 62.74,20.45 67.56,15.62 68.58,14.66 68.63,14.61 v70.74,14.61
PD5
  Top 0.254: IC2.30 53.24,20.45 56.77,20.45 58.42,22.1 70.74,22.1 JP31.7
PD6
  Top 0.254: IC2.31 53.72,21.08 56.39,21.08 58.55,23.24 68.2,23.24 68.33,23.37 JP31.8
PD7
  Top 0.254: JP31.9 70.8,24.7 68.64,24.7 68.54,24.6 58.82,24.6 55.94,21.72 54.2,21.72 IC2.32
PE0
  Top 0.254: IC2.33 54.9,25.97 JP31.10
PE1
  Top 0.254: JP31.11 70.8,27.24 65.98,27.24 65.28,26.54 54.35,26.54 IC2.34
PE4
  Top 0.254: JP31.5 70.8,19.62 64.83,19.62 59.69,14.48 59.05,14.48 54.99,10.41 49.91,10.41 IC2.18
PE5
  Top 0.254: IC2.19 50.52,10.92 54.74,10.92 58.8,14.99 59.44,14.99 65.34,20.89 JP31.6
PE6
  Top 0.254: IC2.1 34.37,22.23 34.37,22.53 R14.1
PE7
  Top 0.254: IC2.2 33.97,20.64 28.07,20.64 27.43,20 27.43,18.48 26.86,17.91 26.86,17.65 R15.1
SCLK  (via drill 0.51)
  Top 0.254: IC2.11 41.77,18.41 v41.91,18.41 | U$34.SCK 89.28,5.59 v89.28,8.26
  Bottom 0.254: v41.91,18.41 44.45,18.41 53.21,9.65 87.88,9.65 v89.28,8.26
X-DIR
  Top 0.254: IC2.50 37.34,37.47 31.11,37.47 P1.DIR
X-MOT-1A
  Bottom 1.778: P1.1A JP1.3
X-MOT-1B
  Bottom 1.778: P1.1B JP1.4
X-MOT-2A
  Bottom 1.778: P1.2A JP1.2
X-MOT-2B
  Bottom 1.778: P1.2B JP1.1
X-MS1
  Top 0.254: R2.1 13.27,41.21 JP9.1
  Bottom 0.254: P1.MS1 JP9.1
X-MS2
  Bottom 0.254: P1.MS2 JP10.1
X-MS3
  Bottom 0.254: P1.MS3 20.19,40.51 22.73,40.51 JP11.1
X-RESETSLEEP
  Bottom 0.254: P1.!RST P1.!SLP
X-STEP
  Top 0.254: IC2.51 36.86,36.83 29.21,36.83 P1.STEP
X-STOP
  Top 0.254: IC2.14 40.01,13.31 40.01,8.26 36.83,5.08 32.26,5.08 JP27.1
XTAL1
  Top 0.254: XTAL.1 51.76,15.88 51.13,15.88 IC2.24
XTAL2
  Top 0.254: IC2.23 50.16,15.73 50.16,14.79 XTAL.2
Y-DIR
  Top 0.254: IC2.48 49.53,37.31 P2.DIR
Y-MOT-1A
  Bottom 1.778: P2.1A JP3.3
Y-MOT-1B
  Bottom 1.778: P2.1B JP3.4
Y-MOT-2A
  Bottom 1.778: P2.2A JP3.2
Y-MOT-2B
  Bottom 1.778: P2.2B JP3.1
Y-MS1
  Top 0.254: JP12.1 R3.1
  Bottom 0.254: P2.MS1 JP12.1
Y-MS2
  Bottom 0.254: P2.MS2 JP13.1
Y-MS3
  Bottom 0.254: P2.MS3 40.51,40.51 43.69,40.51 44.45,41.27 JP14.1
Y-RESETSLEEP
  Bottom 0.254: P2.!RST P2.!SLP
Y-STEP
  Top 0.254: IC2.49 46.99,37.39 P2.STEP
Y-STOP
  Top 0.254: IC2.15 40.64,12.83 40.64,7.62 39.62,6.6 JP28.1
Z-DIR
  Top 0.254: IC2.46 50.64,36.2 67.94,36.2 69.85,38.1 P3.DIR
Z-MOT-1A
  Bottom 1.778: P3.1A JP5.3
Z-MOT-1B
  Bottom 1.778: P3.1B JP5.4
Z-MOT-2A
  Bottom 1.778: P3.2A JP5.2
Z-MOT-2B
  Bottom 1.778: P3.2B JP5.1
Z-MS1
  Top 0.254: JP15.1 R4.1
  Bottom 0.254: P3.MS1 JP15.1
Z-MS2
  Bottom 0.254: P3.MS2 JP16.1
Z-MS3
  Bottom 0.254: JP17.1 63.37,40.51 60.83,40.51 P3.MS3
Z-RESETSLEEP
  Bottom 0.254: P3.!RST P3.!SLP
Z-STEP
  Top 0.254: IC2.47 50.17,36.83 66.67,36.83 67.31,37.47 P3.STEP
Z-STOP
  Top 0.254: IC2.16 41.27,12.35 41.27,7.62 43.81,5.08 46.99,5.08 JP29.1

### Text on the board
Bottom: Nur
_tsilk: X-MOTOR | 12V PWR | Y-MOTOR | 12V PWR | Z-MOTOR | 12V PWR | E-MOTOR | 2B | 2A | 1A | 1B | GND | +12V | 2B | 2A | 1A | 1B | GND | +12V | 2B | 2A | 1A | 1B | GND | +12V | 2B | 2A | 1A | 1B | Extruder | +12V | C1 | C2 | C3 | C4 | Therm. | C5 | MS1 | MS2 | MS3 | MS1 | MS2 | MS3 | MS1 | MS2 | MS3 | MS1 | MS2 | MS3 | LM7805 | Hot End | X-Axis | Y-Axis | Z-Axis | Extruder | -V | C6 | GND | +12V | + | - | +5V | Q1 | Bed | C12 | ATX+4 | -V | Q2 | RESET | 12V | GND | +12V | S1 | Hot Bed | Therm. | Teensylu | 12V | 5V | reprap.org/wiki/Teensylu | SCREW | Endstop Voltage | PWM | TX1 | RX1 | SCL | SDA | E-STOP | GND | +V | SIG | X-STOP | GND | +V | SIG | Y-STOP | GND | +V | SIG | Z-STOP | GND | +V | SIG | 12V | 12V | 5V | D12 | D11 | D10 | D17 | D16 | !RESET | SCK | MISO | ISP/SPI | GND | GND | A5 | A4 | A3 | A2 | A1 | A0 | GND | MOSI | 5V